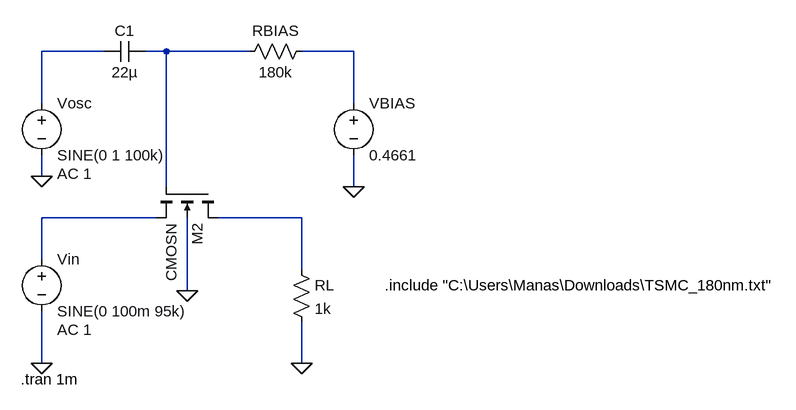
[diagram p0: schematic switch(mixer) design.asc]
switch(mixer) design.asc, the LTspice schematic file:
Version 4
SHEET 1 1036 680
WIRE -64 -112 -160 -112
WIRE 32 -112 0 -112
WIRE 160 -112 32 -112
WIRE 320 -112 240 -112
WIRE -160 -32 -160 -112
WIRE 320 -32 320 -112
WIRE -160 80 -160 48
WIRE 32 96 32 -112
WIRE 320 96 320 48
WIRE 16 144 -160 144
WIRE 240 144 112 144
WIRE -160 208 -160 144
WIRE 240 224 240 144
WIRE 64 256 64 144
WIRE -160 368 -160 288
WIRE 240 368 240 304
FLAG 64 256 0
FLAG 240 368 0
FLAG -160 368 0
FLAG -160 80 0
FLAG 320 96 0
SYMBOL voltage -160 -48 R0
WINDOW 123 24 124 Left 2
WINDOW 39 0 0 Left 0
SYMATTR Value2 AC 1
SYMATTR InstName Vosc
SYMATTR Value SINE(0 1 100k)
SYMBOL voltage -160 192 R0
WINDOW 123 24 124 Left 2
WINDOW 39 0 0 Left 0
SYMATTR Value2 AC 1
SYMATTR InstName Vin
SYMATTR Value SINE(0 100m 95k)
SYMBOL voltage 320 -48 R0
WINDOW 123 0 0 Left 0
WINDOW 39 0 0 Left 0
SYMATTR InstName VBIAS
SYMATTR Value 0.4661
SYMBOL res 224 208 R0
SYMATTR InstName RL
SYMATTR Value 1k
SYMBOL res 256 -128 R90
WINDOW 0 0 56 VBottom 2
WINDOW 3 32 56 VTop 2
SYMATTR InstName RBIAS
SYMATTR Value 180k
SYMBOL cap 0 -128 R90
WINDOW 0 0 32 VBottom 2
WINDOW 3 32 32 VTop 2
SYMATTR InstName C1
SYMATTR Value 22µ
SYMBOL nmos4 112 96 R90
SYMATTR InstName M2
SYMATTR Value CMOSN
SYMATTR Value2 l=0.18u w=1.8u ad={5 * 1.8u * 0.09u} as={5 * 1.8u * 0.09u} pd={10 * 0.09u +2 *1.8u} ps={10 *0.09u + 2 * 1.8u}
TEXT -192 392 Left 2 !.tran 1m
TEXT 368 248 Left 2 !.include "C:\\Users\\Manas\\Downloads\\TSMC_180nm.txt"

The netlist it stands for:
* switch(mixer) design.asc
Vosc N001 0 SINE(0 1 100k) AC 1
Vin N004 0 SINE(0 100m 95k) AC 1
VBIAS N003 0 0.4661
RL N005 0 1k
RBIAS N003 N002 180k
C1 N002 N001 22µ
M2 N005 N002 N004 0 CMOSN l=0.18u w=1.8u ad={5 * 1.8u * 0.09u} as={5 * 1.8u * 0.09u} pd={10 * 0.09u +2 *1.8u} ps={10 *0.09u + 2 * 1.8u}
.model NMOS NMOS
.model PMOS PMOS
.lib standard.mos
.tran 1m
.include "C:\Users\Manas\Downloads\TSMC_180nm.txt"
.backanno
.end